# Altium schematic sheet Bluetooth.SchDoc
size A
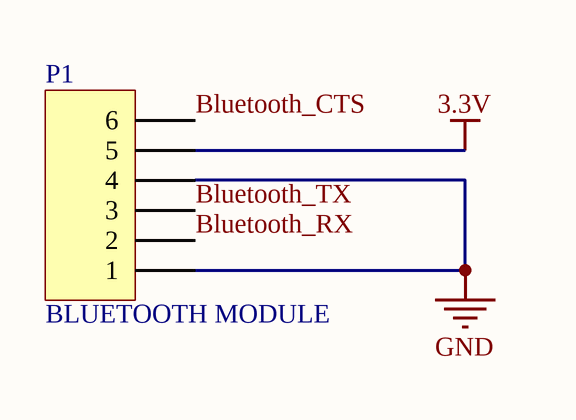
[diagram p0: Bluetooth.SchDoc]

## Parts
P1  BLUETOOTH MODULE  [HDR1X6]

## Nets
3.3V: P1.5
GND: P1.1 P1.4
Bluetooth_CTS: P1.6
Bluetooth_RX: P1.2
Bluetooth_TX: P1.3

## Library data of the parts
P1 = Header 6: Header, 6-Pin; LatestRevisionDate: 17-Jul-2002; LatestRevisionNote: Re-released for DXP Platform.; Publisher: Altium Limited